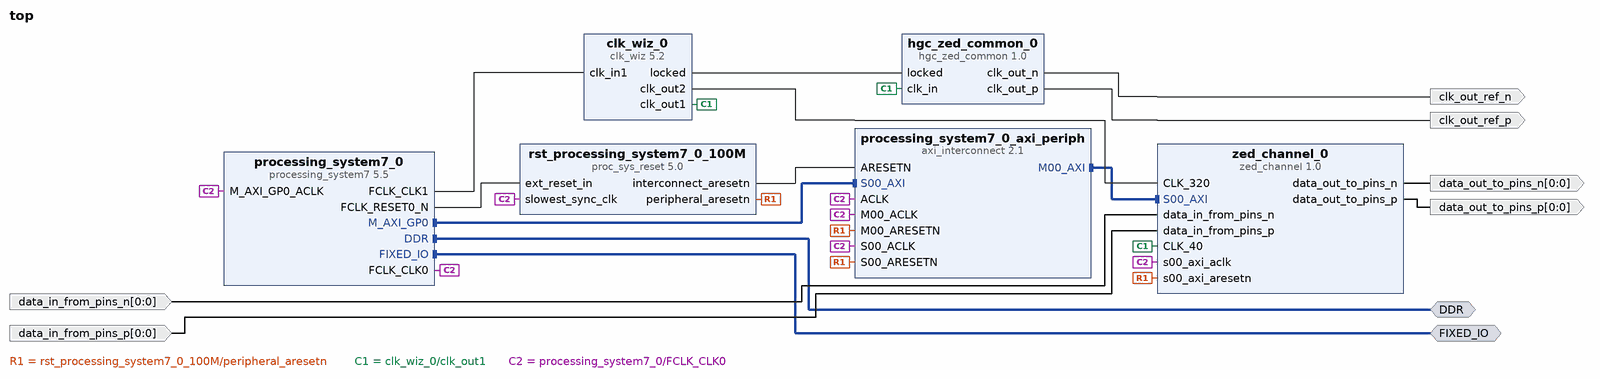
[diagram p0: block diagram of the top level]
# Vivado block design top, Vivado 2015.4
create_bd_design top

create_bd_intf_port -mode Master -vlnv xilinx.com:interface:ddrx_rtl:1.0 DDR
create_bd_intf_port -mode Master -vlnv xilinx.com:display_processing_system7:fixedio_rtl:1.0 FIXED_IO
create_bd_port -dir I -from 0 -to 0 data_in_from_pins_n
create_bd_port -dir I -from 0 -to 0 data_in_from_pins_p
create_bd_port -dir O -from 0 -to 0 data_out_to_pins_n
create_bd_port -dir O -from 0 -to 0 data_out_to_pins_p
create_bd_port -dir O clk_out_ref_p
create_bd_port -dir O clk_out_ref_n

create_bd_cell -type ip -vlnv xilinx.com:ip:clk_wiz:5.2 clk_wiz_0
set_property -dict [list \
  CONFIG.PRIMITIVE MMCM \
  CONFIG.PRIM_IN_FREQ 40 \
  CONFIG.CLKOUT2_USED true \
  CONFIG.CLKOUT1_REQUESTED_OUT_FREQ 40 \
  CONFIG.CLKOUT2_REQUESTED_OUT_FREQ 320 \
  CONFIG.PRIM_SOURCE Global_buffer \
  CONFIG.USE_RESET false \
  CONFIG.USE_BOARD_FLOW false \
] [get_bd_cells clk_wiz_0]
create_bd_cell -type ip -vlnv fnal.gov:user:hgc_zed_common:1.0 hgc_zed_common_0
create_bd_cell -type ip -vlnv xilinx.com:ip:processing_system7:5.5 processing_system7_0
set_property -dict [list \
  CONFIG.PCW_FPGA0_PERIPHERAL_FREQMHZ 40 \
  CONFIG.PCW_FPGA1_PERIPHERAL_FREQMHZ 40 \
  CONFIG.PCW_EN_CLK1_PORT 1 \
  CONFIG.preset ZedBoard \
] [get_bd_cells processing_system7_0]
# 3 more settings of processing_system7_0 are not shown: defaults, MIO pin electricals, DDR timing, and values the tool derives
create_bd_cell -type ip -vlnv xilinx.com:ip:axi_interconnect:2.1 processing_system7_0_axi_periph
set_property -dict {CONFIG.NUM_MI 1} [get_bd_cells processing_system7_0_axi_periph]
create_bd_cell -type ip -vlnv xilinx.com:ip:proc_sys_reset:5.0 rst_processing_system7_0_100M
create_bd_cell -type ip -vlnv fnal.gov:ip:zed_channel:1.0 zed_channel_0

# ---- connections ----

connect_bd_intf_net [get_bd_intf_pins processing_system7_0/M_AXI_GP0] [get_bd_intf_pins processing_system7_0_axi_periph/S00_AXI]
connect_bd_intf_net [get_bd_intf_pins processing_system7_0_axi_periph/M00_AXI] [get_bd_intf_pins zed_channel_0/S00_AXI]
connect_bd_intf_net [get_bd_intf_ports DDR] [get_bd_intf_pins processing_system7_0/DDR]
connect_bd_intf_net [get_bd_intf_ports FIXED_IO] [get_bd_intf_pins processing_system7_0/FIXED_IO]
connect_bd_net [get_bd_pins processing_system7_0/FCLK_RESET0_N] [get_bd_pins rst_processing_system7_0_100M/ext_reset_in]
connect_bd_net [get_bd_pins rst_processing_system7_0_100M/peripheral_aresetn] \
  [get_bd_pins processing_system7_0_axi_periph/S00_ARESETN] [get_bd_pins processing_system7_0_axi_periph/M00_ARESETN] \
  [get_bd_pins zed_channel_0/s00_axi_aresetn]
connect_bd_net [get_bd_pins rst_processing_system7_0_100M/interconnect_aresetn] [get_bd_pins processing_system7_0_axi_periph/ARESETN]
connect_bd_net [get_bd_ports data_in_from_pins_n] [get_bd_pins zed_channel_0/data_in_from_pins_n]
connect_bd_net [get_bd_ports data_in_from_pins_p] [get_bd_pins zed_channel_0/data_in_from_pins_p]
connect_bd_net [get_bd_pins zed_channel_0/data_out_to_pins_n] [get_bd_ports data_out_to_pins_n]
connect_bd_net [get_bd_pins zed_channel_0/data_out_to_pins_p] [get_bd_ports data_out_to_pins_p]
connect_bd_net [get_bd_pins processing_system7_0/FCLK_CLK1] [get_bd_pins clk_wiz_0/clk_in1]
connect_bd_net [get_bd_pins clk_wiz_0/clk_out2] [get_bd_pins zed_channel_0/CLK_320]
connect_bd_net [get_bd_pins clk_wiz_0/locked] [get_bd_pins hgc_zed_common_0/locked]
connect_bd_net [get_bd_pins hgc_zed_common_0/clk_out_p] [get_bd_ports clk_out_ref_p]
connect_bd_net [get_bd_pins hgc_zed_common_0/clk_out_n] [get_bd_ports clk_out_ref_n]
connect_bd_net [get_bd_pins clk_wiz_0/clk_out1] [get_bd_pins hgc_zed_common_0/clk_in] [get_bd_pins zed_channel_0/CLK_40]
connect_bd_net [get_bd_pins processing_system7_0/FCLK_CLK0] \
  [get_bd_pins processing_system7_0/M_AXI_GP0_ACLK] [get_bd_pins processing_system7_0_axi_periph/ACLK] \
  [get_bd_pins processing_system7_0_axi_periph/S00_ACLK] [get_bd_pins processing_system7_0_axi_periph/M00_ACLK] \
  [get_bd_pins rst_processing_system7_0_100M/slowest_sync_clk] [get_bd_pins zed_channel_0/s00_axi_aclk]

# ---- address map ----
assign_bd_address -offset 0x43C00000 -range 64K -target_address_space [get_bd_addr_spaces processing_system7_0/Data] [get_bd_addr_segs zed_channel_0/S00_AXI/Reg]

validate_bd_design
save_bd_design
